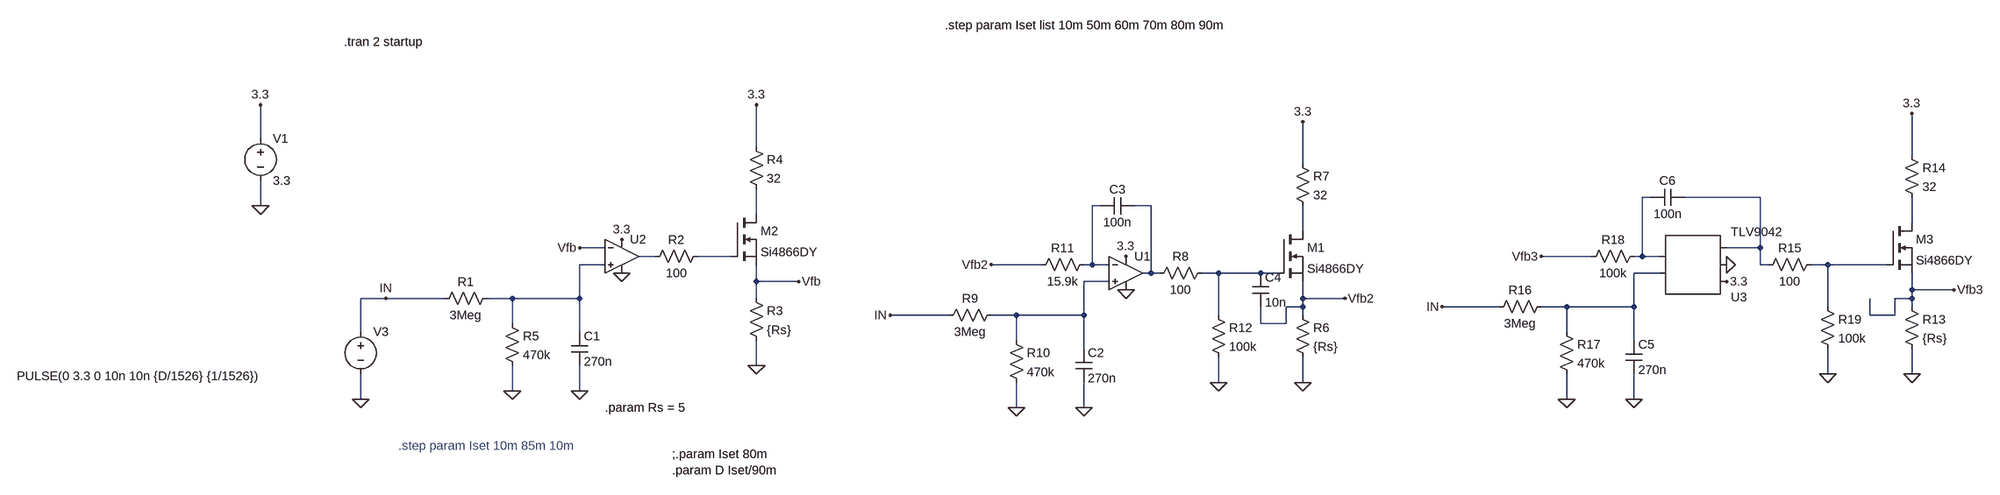
[diagram p0: schematic Test_Bed.asc]
Test_Bed.asc, the LTspice schematic file:
Version 4
SHEET 1 3848 824
WIRE 400 16 400 -48
WIRE 1344 32 1344 -48
WIRE 3696 48 3696 -32
WIRE 2512 64 2512 -16
WIRE 3200 128 3184 128
WIRE 3408 128 3264 128
WIRE 400 144 400 96
WIRE 2128 144 2112 144
WIRE 2224 144 2192 144
WIRE 1344 160 1344 112
WIRE 3696 176 3696 128
WIRE 2512 192 2512 144
WIRE 1056 224 1008 224
WIRE 3408 224 3408 128
WIRE 3408 224 3344 224
WIRE 1152 240 1120 240
WIRE 1296 240 1232 240
WIRE 3088 240 2992 240
WIRE 3184 240 3184 128
WIRE 3184 240 3168 240
WIRE 3216 240 3184 240
WIRE 1056 256 1008 256
WIRE 2016 256 1920 256
WIRE 2112 256 2112 144
WIRE 2112 256 2096 256
WIRE 2144 256 2112 256
WIRE 3408 256 3408 224
WIRE 3424 256 3408 256
WIRE 3536 256 3504 256
WIRE 3648 256 3536 256
WIRE 2224 272 2224 144
WIRE 2224 272 2208 272
WIRE 2240 272 2224 272
WIRE 2352 272 2320 272
WIRE 2432 272 2352 272
WIRE 2464 272 2432 272
WIRE 3216 272 3168 272
WIRE 1344 288 1344 256
WIRE 1424 288 1344 288
WIRE 2144 288 2096 288
WIRE 3696 304 3696 272
WIRE 3776 304 3696 304
WIRE 640 320 592 320
WIRE 752 320 640 320
WIRE 880 320 832 320
WIRE 1008 320 1008 256
WIRE 1008 320 880 320
WIRE 1344 320 1344 288
WIRE 2512 320 2512 288
WIRE 2592 320 2512 320
WIRE 3696 320 3696 304
WIRE 3696 320 3664 320
WIRE 2512 336 2512 320
WIRE 2512 336 2480 336
WIRE 2912 336 2800 336
WIRE 3040 336 2992 336
WIRE 3168 336 3168 272
WIRE 3168 336 3040 336
WIRE 3536 336 3536 256
WIRE 3696 336 3696 320
WIRE 1840 352 1728 352
WIRE 1968 352 1920 352
WIRE 2096 352 2096 288
WIRE 2096 352 1968 352
WIRE 2352 352 2352 272
WIRE 2512 352 2512 336
WIRE 3616 352 3616 320
WIRE 3664 352 3664 320
WIRE 3664 352 3616 352
WIRE 880 368 880 320
WIRE 2432 368 2432 336
WIRE 2480 368 2480 336
WIRE 2480 368 2432 368
WIRE 592 384 592 320
WIRE 1008 384 1008 320
WIRE 3040 384 3040 336
WIRE 1968 400 1968 352
WIRE 3168 400 3168 336
WIRE 2096 416 2096 352
WIRE 1344 448 1344 400
WIRE 3536 464 3536 416
WIRE 3696 464 3696 416
WIRE 2352 480 2352 432
WIRE 2512 480 2512 432
WIRE 880 496 880 448
WIRE 1008 496 1008 448
WIRE 592 512 592 464
WIRE 3040 512 3040 464
WIRE 3168 512 3168 464
WIRE 1968 528 1968 480
WIRE 2096 528 2096 480
FLAG 400 144 0
FLAG 1344 448 0
FLAG 400 -48 3.3
FLAG 1088 208 3.3
FLAG 1088 272 0
FLAG 592 512 0
FLAG 1424 288 Vfb
FLAG 1008 224 Vfb
FLAG 880 496 0
FLAG 1008 496 0
FLAG 1344 -48 3.3
FLAG 640 320 IN
FLAG 2512 480 0
FLAG 2176 240 3.3
FLAG 2176 304 0
FLAG 2592 320 Vfb2
FLAG 1920 256 Vfb2
FLAG 1968 528 0
FLAG 2096 528 0
FLAG 2512 -16 3.3
FLAG 1728 352 IN
FLAG 2352 480 0
FLAG 3696 464 0
FLAG 3344 288 3.3
FLAG 3344 256 0
FLAG 3776 304 Vfb3
FLAG 2992 240 Vfb3
FLAG 3040 512 0
FLAG 3168 512 0
FLAG 3696 -32 3.3
FLAG 2800 336 IN
FLAG 3536 464 0
SYMBOL voltage 400 0 R0
WINDOW 123 0 0 Left 0
WINDOW 39 0 0 Left 0
SYMATTR InstName V1
SYMATTR Value 3.3
SYMBOL res 1328 304 R0
SYMATTR InstName R3
SYMATTR Value {Rs}
SYMBOL voltage 592 368 R0
WINDOW 123 0 0 Left 0
WINDOW 39 0 0 Left 0
WINDOW 3 -655 100 Left 2
SYMATTR InstName V3
SYMATTR Value PULSE(0 3.3 0 10n 10n {D/1526} {1/1526})
SYMBOL res 1328 16 R0
SYMATTR InstName R4
SYMATTR Value 32
SYMBOL OpAmps\\UniversalOpAmp2 1088 240 R0
SYMATTR InstName U2
SYMATTR Value2 Avol=100k GBW=350k Slew=200k
SYMBOL res 1248 224 R90
WINDOW 0 0 56 VBottom 2
WINDOW 3 32 56 VTop 2
SYMATTR InstName R2
SYMATTR Value 100
SYMBOL nmos 1296 160 R0
SYMATTR InstName M2
SYMATTR Value Si4866DY
SYMBOL res 848 304 R90
WINDOW 0 0 56 VBottom 2
WINDOW 3 32 56 VTop 2
SYMATTR InstName R1
SYMATTR Value 3Meg
SYMBOL res 864 352 R0
SYMATTR InstName R5
SYMATTR Value 470k
SYMBOL cap 992 384 R0
SYMATTR InstName C1
SYMATTR Value 270n
SYMBOL res 2496 336 R0
SYMATTR InstName R6
SYMATTR Value {Rs}
SYMBOL res 2496 48 R0
SYMATTR InstName R7
SYMATTR Value 32
SYMBOL res 2336 256 R90
WINDOW 0 0 56 VBottom 2
WINDOW 3 32 56 VTop 2
SYMATTR InstName R8
SYMATTR Value 100
SYMBOL nmos 2464 192 R0
SYMATTR InstName M1
SYMATTR Value Si4866DY
SYMBOL res 1936 336 R90
WINDOW 0 0 56 VBottom 2
WINDOW 3 32 56 VTop 2
SYMATTR InstName R9
SYMATTR Value 3Meg
SYMBOL res 1952 384 R0
SYMATTR InstName R10
SYMATTR Value 470k
SYMBOL cap 2080 416 R0
SYMATTR InstName C2
SYMATTR Value 270n
SYMBOL res 2112 240 R90
WINDOW 0 0 56 VBottom 2
WINDOW 3 32 56 VTop 2
SYMATTR InstName R11
SYMATTR Value 15.9k
SYMBOL cap 2192 128 R90
WINDOW 0 0 32 VBottom 2
WINDOW 3 32 32 VTop 2
SYMATTR InstName C3
SYMATTR Value 100n
SYMBOL OpAmps\\UniversalOpAmp2 2176 272 R0
SYMATTR InstName U1
SYMATTR Value2 Avol=100k GBW=350k Slew=200k
SYMBOL cap 2416 272 R0
SYMATTR InstName C4
SYMATTR Value 10n
SYMBOL res 2336 336 R0
SYMATTR InstName R12
SYMATTR Value 100k
SYMBOL res 3680 320 R0
SYMATTR InstName R13
SYMATTR Value {Rs}
SYMBOL res 3680 32 R0
SYMATTR InstName R14
SYMATTR Value 32
SYMBOL res 3520 240 R90
WINDOW 0 0 56 VBottom 2
WINDOW 3 32 56 VTop 2
SYMATTR InstName R15
SYMATTR Value 100
SYMBOL nmos 3648 176 R0
SYMATTR InstName M3
SYMATTR Value Si4866DY
SYMBOL res 3008 320 R90
WINDOW 0 0 56 VBottom 2
WINDOW 3 32 56 VTop 2
SYMATTR InstName R16
SYMATTR Value 3Meg
SYMBOL res 3024 368 R0
SYMATTR InstName R17
SYMATTR Value 470k
SYMBOL cap 3152 400 R0
SYMATTR InstName C5
SYMATTR Value 270n
SYMBOL res 3184 224 R90
WINDOW 0 0 56 VBottom 2
WINDOW 3 32 56 VTop 2
SYMATTR InstName R18
SYMATTR Value 100k
SYMBOL cap 3264 112 R90
WINDOW 0 0 32 VBottom 2
WINDOW 3 32 32 VTop 2
SYMATTR InstName C6
SYMATTR Value 100n
SYMBOL res 3520 320 R0
SYMATTR InstName R19
SYMATTR Value 100k
SYMBOL AutoGenerated\\TLV9042 3280 256 M180
SYMATTR InstName U3
TEXT 560 -168 Left 2 !.tran 2 startup
TEXT 1056 528 Left 2 !.param Rs = 5
TEXT 664 600 Left 2 ;.step param Iset 10m 85m 10m
TEXT 1184 616 Left 2 !;.param Iset 80m\n.param D Iset/90m
TEXT 1832 -200 Left 2 !.step param Iset list 10m 50m 60m 70m 80m 90m

The netlist it stands for:
* Test_Bed.asc
V1 3.3 0 3.3
R3 Vfb 0 {Rs}
V3 IN 0 PULSE(0 3.3 0 10n 10n {D/1526} {1/1526})
R4 3.3 N005 32
XU2 N010 Vfb 3.3 0 N008 level2 Avol=100k GBW=350k Slew=200k Ilimit=25m Rail=0 Vos=0 En=0 Enk=0 In=0 Ink=0 Rin=500Meg  ; pins In+ In- V+ V- OUT
R2 N009 N008 100
M2 N005 N009 Vfb Vfb Si4866DY
R1 N010 IN 3Meg
R5 N010 0 470k
C1 N010 0 270n
R6 Vfb2 0 {Rs}
R7 3.3 N007 32
R8 N012 N004 100
M1 N007 N012 Vfb2 Vfb2 Si4866DY
R9 N014 IN 3Meg
R10 N014 0 470k
C2 N014 0 270n
R11 N003 Vfb2 15.9k
C3 N004 N003 100n
XU1 N014 N003 3.3 0 N004 level2 Avol=100k GBW=350k Slew=200k Ilimit=25m Rail=0 Vos=0 En=0 Enk=0 In=0 Ink=0 Rin=500Meg  ; pins In+ In- V+ V- OUT
C4 N012 Vfb2 10n
R12 N012 0 100k
R13 Vfb3 0 {Rs}
R14 3.3 N006 32
R15 N011 N002 100
M3 N006 N011 Vfb3 Vfb3 Si4866DY
R16 N013 IN 3Meg
R17 N013 0 470k
C5 N013 0 270n
R18 N001 Vfb3 100k
C6 N002 N001 100n
R19 N011 0 100k
* U3: TLV9042 (symbol AutoGenerated\TLV9042 not available, pins judged from their places): pin1=N013 pin2=N001 pin3=3.3 pin4=0 pin5=N002
.model NMOS NMOS
.model PMOS PMOS
.lib standard.mos
.tran 2 startup
.param Rs = 5
* .step param Iset 10m 85m 10m
;.param Iset 80m
.param D Iset/90m
.step param Iset list 10m 50m 60m 70m 80m 90m
.lib UniversalOpAmp2.lib
.backanno
.end